# EAGLE design LoRa ST Sensor Node v2.0 (EAGLE 7.5.0)
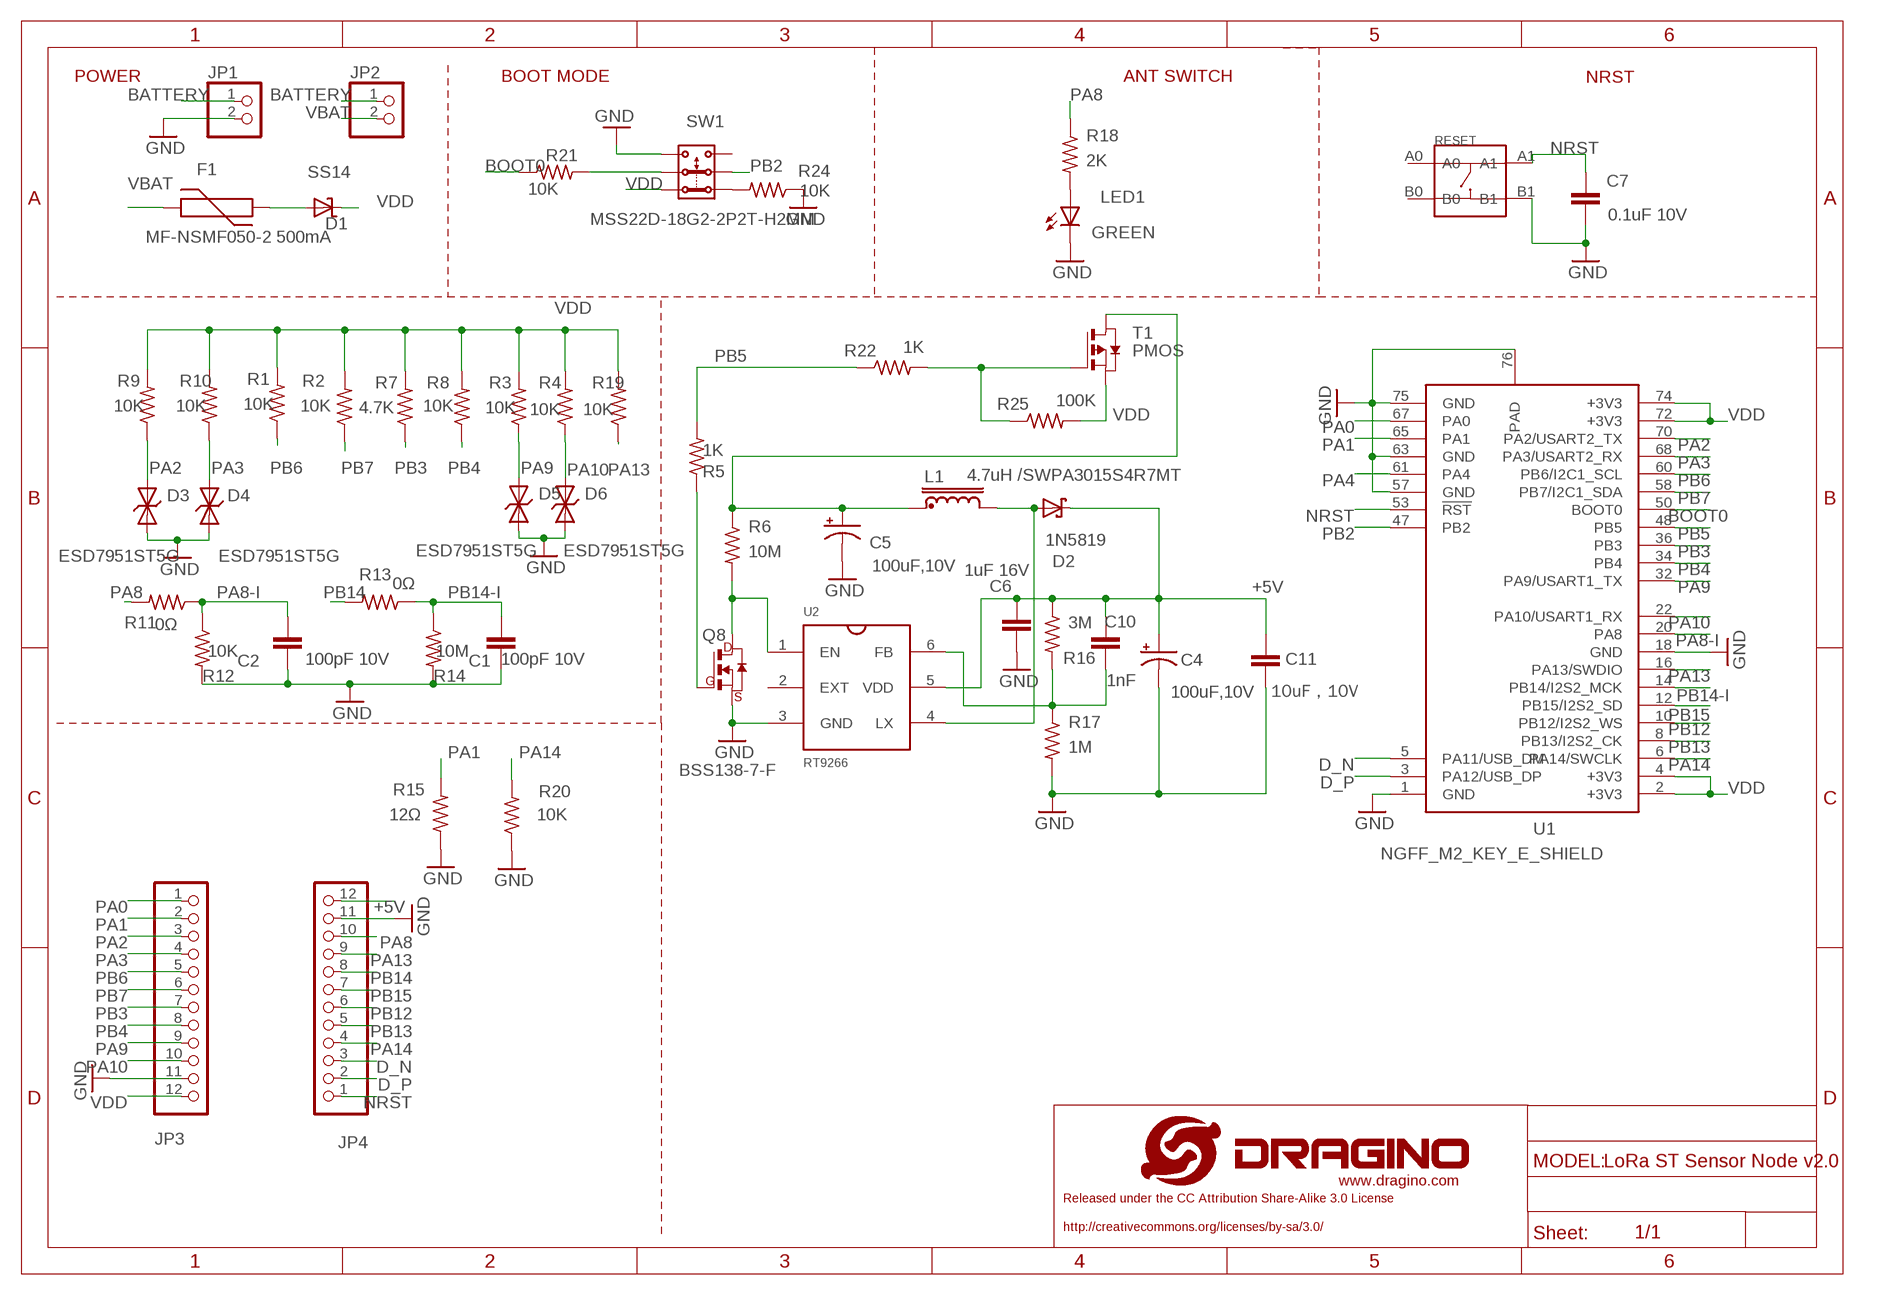
[diagram p0: schematic, sheet 1]

## Parts
C1  100pF 10V  C-EUC0603  [C0603]
C2  100pF 10V  C-EUC0603  [C0603]
C4  100uF,10V  CPOL-USSMCB  [SMC_B]
C5  100uF,10V  CPOL-USSMCB  [SMC_B]
C6  1uF 16V  C-EUC0603  [C0603]
C7  0.1uF 10V  C-EUC0402  [C0402]
C10  1nF  C-EUC0402  [C0402]
C11  10uF，10V  C-EUC0805  [C0805]
D1  SS14  SCHOTTKYSMBG  [DO214AC]
D2  1N5819  SMF5.0AT1  [SOD123FL]
D3  ESD7951ST5G  TVSSOD−923  [SOD−923]
D4  ESD7951ST5G  TVSSOD−923  [SOD−923]
D5  ESD7951ST5G  TVSSOD−923  [SOD−923]
D6  ESD7951ST5G  TVSSOD−923  [SOD−923]
F1  MF-NSMF050-2 500mA  FUSE1206  [R1206]
JP1  PINHD-1X2L  [XH2.54-2P-L]
JP2  PINHD-1X2  [1X02]
JP3  PINHD-1X12""  [1X12-DIP]
JP4  PINHD-1X12""  [1X12-DIP]
L1  4.7uH /SWPA3015S4R7MT  INDUCTORSWPA3010S  [SWPA3010S]
LED1  GREEN  LEDCHIPLED_0603  [CHIPLED_0603]
Q8  BSS138-7-F  NMOSFET  [SOT-23]
R1  10K  R-US_R0402  [R0402]
R2  10K  R-US_R0402  [R0402]
R3  10K  R-US_R0402  [R0402]
R4  10K  R-US_R0402  [R0402]
R5  1K  R-US_R0402  [R0402]
R6  10M  R-US_R0402  [R0402]
R7  4.7K  R-US_R0402  [R0402]
R8  10K  R-US_R0402  [R0402]
R9  10K  R-US_R0402  [R0402]
R10  10K  R-US_R0402  [R0402]
R11  0Ω  R-US_R0603  [R0603]
R12  10K  R-US_R0603  [R0603]
R13  0Ω  R-US_R0603  [R0603]
R14  10M  R-US_R0603  [R0603]
R15  12Ω  R-US_R1206  [R1206@1]
R16  3M  R-US_R0402  [R0402]
R17  1M  R-US_R0402  [R0402]
R18  2K  R-US_R0402  [R0402]
R19  10K  R-US_R0402  [R0402]
R20  10K  R-US_R0402  [R0402]
R21  10K  R-US_R0402  [R0402]
R22  1K  R-US_R0402  [R0402]
R24  10K  R-US_R0402  [R0402]
R25  100K  R-US_R0402  [R0402]
RESET  轻触开关3*3*1.5四脚贴片开关  BUTTON-4P-3.3X3.3  [SW4-SMD-3.35X3.35X1.5MM]
SW1  MSS22D-18G2-2P2T-H2MM  [MSS22D-18G2-2P2T-H2MM-DIL]
T1  PMOS  PMOSSOT23  [SOT-23]
U1  NGFF_M2_KEY_E_SHIELD  [NGFF_M2_KEY_E_SHIELD]
U2  RT9266  [6/SOT-23]

## Nets
+5V: C4.+ C6.2 C10.2 C11.2 D2.C JP4.12 R16.1 U2.5(VDD)
BATTERY: JP1.1 JP2.1
BOOT0: R21.1 U1.50(BOOT0)
D_N: JP4.3 U1.5(PA11/USB_DM)
D_P: JP4.2 U1.3(PA12/USB_DP)
GND: C1.1 C2.1 C4.- C5.- C6.1 C7.1 C11.1 D3.P$2 D4.P$2 D5.P$2 D6.P$2 JP1.2 JP3.11 JP4.11 LED1.C Q8.2(S) R12.2 R14.2 R15.1 R17.2 R20.1 R24.1 RESET.B1 SW1.1 U1.1(GND) U1.18(GND) U1.57(GND) U1.63(GND) U1.75(GND) U1.76(PAD) U2.3(GND)
N$3: LED1.A R18.2
N$4: R24.2 SW1.4
N$5: Q8.3(G) R5.1
N$6: C10.1 R16.2 R17.1 U2.6(FB)
N$7: D2.A L1.P$2 U2.4(LX)
N$9: Q8.1(D) R6.2 U2.1(EN)
N$10: R22.2 R25.1 T1.3(G)
N$11: D1.A F1.1
N$13: C5.+ L1.P$1 R6.1 T1.1(D)
N$22: R21.2 SW1.2
NRST: C7.2 JP4.1 RESET.A1 U1.53(!RST)
PA0: JP3.1 U1.67(PA0)
PA1: JP3.2 R15.2 U1.65(PA1)
PA2: D3.P$1 JP3.3 R9.1 U1.70(PA2/USART2_TX)
PA3: D4.P$1 JP3.4 R10.1 U1.68(PA3/USART2_RX)
PA4: U1.61(PA4)
PA8: JP4.10 R11.2 R18.1
PA8-I: C2.2 R11.1 R12.1 U1.20(PA8)
PA9: D5.P$1 JP3.9 R3.1 U1.32(PA9/USART1_TX)
PA10: D6.P$1 JP3.10 R4.1 U1.22(PA10/USART1_RX)
PA13: JP4.9 R19.1 U1.16(PA13/SWDIO)
PA14: JP4.4 R20.2 U1.6(PA14/SWCLK)
PB2: SW1.5 U1.47(PB2)
PB3: JP3.7 R7.1 U1.36(PB3)
PB4: JP3.8 R8.1 U1.34(PB4)
PB5: R5.2 R22.1 U1.48(PB5)
PB6: JP3.5 R1.1 U1.60(PB6/I2C1_SCL)
PB7: JP3.6 R2.1 U1.58(PB7/I2C1_SDA)
PB12: JP4.6 U1.10(PB12/I2S2_WS)
PB13: JP4.5 U1.8(PB13/I2S2_CK)
PB14: JP4.8 R13.2
PB14-I: C1.2 R13.1 R14.1 U1.14(PB14/I2S2_MCK)
PB15: JP4.7 U1.12(PB15/I2S2_SD)
VBAT: F1.2 JP2.2
VDD: D1.C JP3.12 R1.2 R2.2 R3.2 R4.2 R7.2 R8.2 R9.2 R10.2 R19.2 R25.2 SW1.3 T1.2(S) U1.2(+3V3) U1.4(+3V3) U1.72(+3V3) U1.74(+3V3)
Unconnected: RESET.A0 RESET.B0 SW1.6 U2.2(EXT)

## Notes on the sheet
- NRST
- POWER | BOOT MODE | ANT SWITCH

## Library data of the parts
C1 C2 C6 C7 C10 = dragino:C-EU: CAPACITOR, European symbol
C4 C5 = rcl:CPOL-US: POLARIZED CAPACITOR, American symbol
C11 = dragino-passive:C-EU: CAPACITOR, European symbol
D1 = dragino:SCHOTTKY: Suppressor diode; OC_FARNELL: unknown
D2 = diode:SMF5.0AT1: 200 W Transient Voltage Suppressor Source: Data sheet <http://www.onsemi.com/pub_link/Collateral/SMF5.0AT1-D.PDF>
D3-D6 = dragino:TVS: DIODE
F1 = dragino:FUSE: FUSE 5 x 20 mm
JP1 JP2 = pinhead:PINHD-1X2: PIN HEADER
JP3 JP4 = pinhead:PINHD-1X12: PIN HEADER
L1 = dragino:INDUCTOR: CHOKE U15
LED1 = dragino:LED: LED OSRAM: - CHIPLED LG R971, LG N971, LY N971, LG Q971, LY Q971, LO R971, LY R971 LH N974, LH R974 LS Q976, LO Q976, LY Q976 LO Q996 - Hyper CHIPLED LW Q18S LB Q993, LB Q99A, LB R99A - SideLED LS A670, LO A670, LY A670, LG A670, LP A670 LB A673, LV A673, LT A673, LW A673 LH A674 LY A675 LS A676, LA A676, LO A676, LY A676, LW A676 LS A679, LY A679, LG A679 - Hyper Micro SIDELED® LS Y876, LA Y876, LO Y876, LY Y876 LT Y87S - SmartLED LW L88C, LW L88S LB L89C, LB L89S, LG L890 LS L89K, LO L89K, LY L89K LS L896, LA L896, LO L896, LY L896 - TOPLED LS T670, LO T670, LY T670, LG T670, LP T670 LSG T670, LSP T670, LSY T670, LOP T670, LYG T670 LG T671, LOG T671, LSG T671 LB T673, LV T673, LT T673, LW T673 LH T674 LS T676, LA T676, LO T676, LY T676, LB T676, LH T676, LSB T676, LW T676 LB T67C, LV T67C, LT T67C, LS T67K, LO T67K, LY T67K, LW E67C LS E67B, LA E67B, LO E67B, LY E67B, LB E67C, LV E67C, LT E67C LW T67C LS T679, LY T679, LG T679 LS T770, LO T770, LY T770, LG T770, LP T770 LB T773, LV T773, LT T773, LW T773 LH T774 LS E675, LA E675, LY E675, LS T675 LS T776, LA T776, LO T776, LY T776, LB T776 LHGB T686 LT T68C, LB T68C - Hyper Mini TOPLED® LB M676 - Mini TOPLED Santana® LG M470 LS M47K, LO M47K, LY M47K Source: http://www.osram.convergy.de LUXEON: - LUMILED® LXK2-PW12-R00, LXK2-PW12-S00, LXK2-PW14-U00, LXK2-PW14-V00 LXK2-PM12-R00, LXK2-PM12-S00, LXK2-PM14-U00 LXK2-PE12-Q00, LXK2-PE12-R00, LXK2-PE12-S00, LXK2-PE14-T00, LXK2-PE14-U00 LXK2-PB12-K00, LXK2-PB12-L00, LXK2-PB12-M00, LXK2-PB14-N00, LXK2-PB14-P00, LXK2-PB14-Q00 LXK2-PR12-L00, LXK2-PR12-M00, LXK2-PR14-Q00, LXK2-PR14-R00 LXK2-PD12-Q00, LXK2-PD12-R00, LXK2-PD12-S00 LXK2-PH12-R00, LXK2-PH12-S00 LXK2-PL12-P00, LXK2-PL12-Q00, LXK2-PL12-R00 Source: www.luxeon.com KINGBRIGHT: KA-3528ASYC Source: www.kingbright.com
Q8 = dragino:NMOSFET: MOS FET; OC_FARNELL: unknown; OC_NEWARK: unknown
R1-R22 R24 R25 = dragino:R-US_: RESISTOR, American symbol
RESET = dragino:BUTTON-4P: SW4-6.0X6.0X5.0MM:311020024;SW4-8.0X8.0X9.0MM:311020028;SW4-SMD-6.0X6.0X5.0MM:311020004;SW4-SMD-3.35X3.35X1.5MM:311020030;SW4-SMD-5.2X5.2X2.5MM:311020046
SW1 = dragino:MSS22D-18G2-2P2T-H2MM
T1 = zetex:PMOSSOT23: MOS FET; OC_FARNELL: unknown; OC_NEWARK: unknown
U1 = dragino:NGFF_M2_KEY_E_SHIELD
U2 = dragino:RT9266

## Net classes
0 default: width 0.203 mm, clearance 0.203 mm
1 vcc: width 0.254 mm

## Board
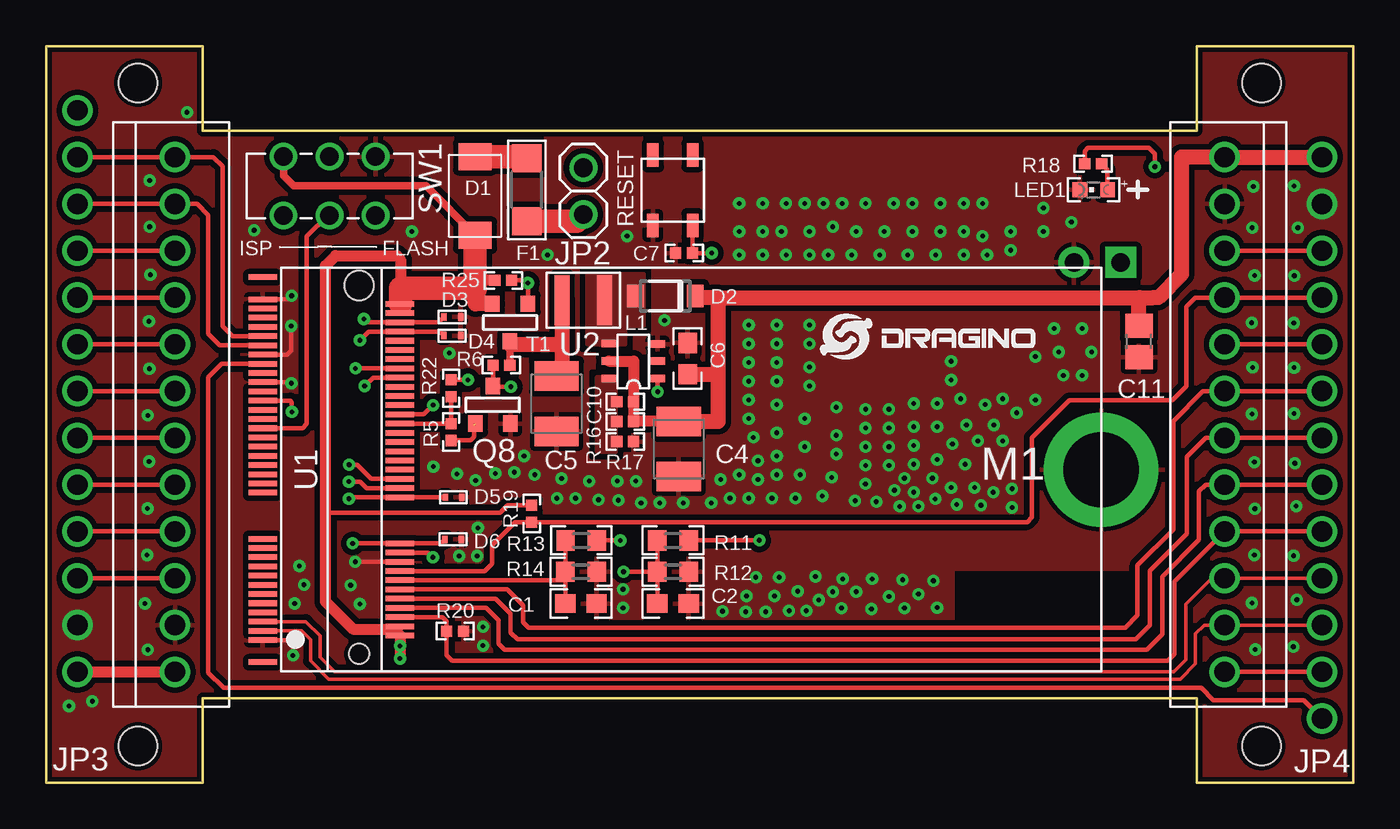
[diagram p1: board, top side]
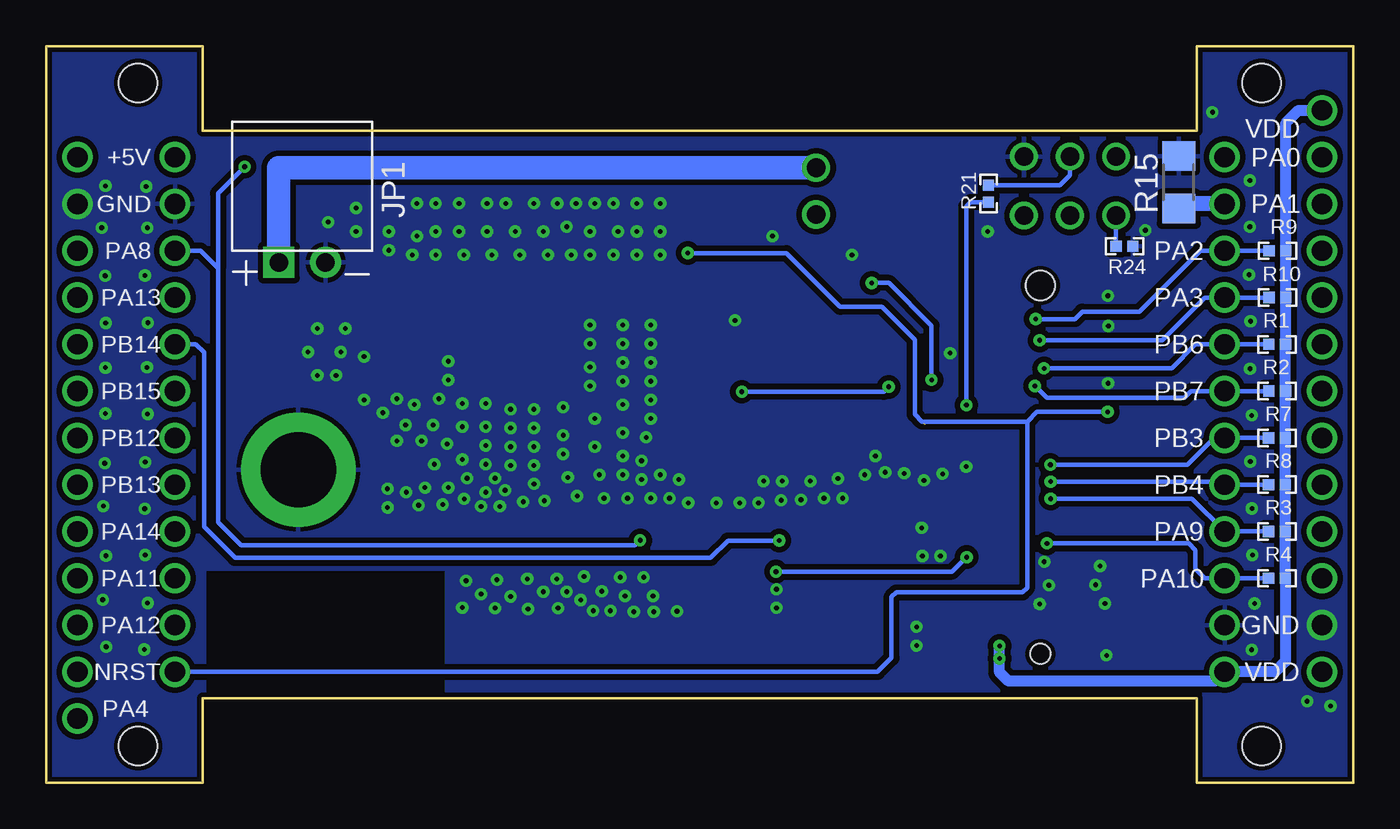
[diagram p2: board, bottom side, seen from below]

Size 71 x 40 mm. Coordinates in mm from the lower left corner, seen from the top.
Copper layers (1*16): Top 0.035mm / dielectric 1.5mm / Bottom 0.035mm
Design rules "default *": minimum track width 6mil, minimum drill 10mil, track to track 12mil, track to pad 20mil, pad to pad 10mil, via to via 10mil, smd to smd 8mil, copper to edge 10mil, drill to drill 8mil, minimum pad ring 10mil, minimum via ring 8mil, stop-mask expansion 4mil, vias tented up to drill 30mil, thermal gap 10mil

### Footprints (pad centres in the part's own frame; a part is rotated, then mirrored left to right if it is on the bottom)
C0603 = smd 1.1 x 1: 1 -0.85,0; 2 0.85,0
SMC_B = smd 1.6 x 2.4: + -1.5,0; - 1.5,0
C0402 = smd 0.61 x 0.61: 1 -0.457,0; 2 0.457,0
C0805 = smd 1.3 x 1.5: 1 -0.85,0; 2 0.85,0
DO214AC = smd 1.45 x 1.8: A 2.13,0; C -2.13,0
SOD123FL = smd 0.91 x 1.22: A 1.625,0; C -1.625,0
SOD−923 = smd 0.3 x 0.4: P$1 -0.45,0; P$2 0.45,0
R1206 = smd 1.52 x 1.6: 1 -1.71,0; 2 1.71,0
XH2.54-2P-L = drill 1 pad 1.676 square: 1 -1.27,-0.635 | drill 1 pad 1.676: 2 1.27,-0.635
1X02 = drill 1.016: 1 -1.27,0; 2 1.27,0
1X12-DIP = drill 1.1: 1 -13.97,0; 2 -11.43,0; 3 -8.89,0; 4 -6.35,0; 5 -3.81,0; 6 -1.27,0; 7 1.27,0; 8 3.81,0; 9 6.35,0; 10 8.89,0; 11 11.43,0; 12 13.97,0
SWPA3010S = smd 0.8 x 2.7: P$1 -1.15,0; P$2 1.15,0
CHIPLED_0603 = smd 0.8 x 0.8: A 0,-0.75; C 0,0.75
SOT-23 = smd 0.787 x 0.889: 1 0,-1.016; 2 -0.95,1.016; 3 0.95,1.016
R0402 = smd 0.61 x 0.61: 1 -0.457,0; 2 0.457,0
R0603 = smd 1 x 1.1: 1 -0.85,0; 2 0.85,0
R1206@1 = smd 1.6 x 1.803: 1 -1.422,0; 2 1.422,0
SW4-SMD-3.35X3.35X1.5MM = smd 1.27 x 0.635: A0 -1.905,1.079; A1 1.905,1.079; B0 -1.905,-1.079; B1 1.905,-1.079
MSS22D-18G2-2P2T-H2MM-DIL = drill 1: 1 -2.5,-1.6; 2 0,-1.6; 3 2.5,-1.6; 4 2.5,1.6; 5 0,1.6; 6 -2.5,1.6
SOT-23' = smd 0.787 x 0.889: 1 0.025,-1.016; 2 -0.94,1.016; 3 0.991,1.016
NGFF_M2_KEY_E_SHIELD = smd 0.3 x 1.55: 1 1.7,-0.775; 2 1.95,-8.225; 3 2.2,-0.775; 4 2.45,-8.225; 5 2.7,-0.775; 6 2.95,-8.225; 7 3.2,-0.775; 8 3.45,-8.225; 9 3.7,-0.775; 10 3.95,-8.225; 11 4.2,-0.775; 12 4.45,-8.225; 13 4.7,-0.775; 14 4.95,-8.225; 15 5.2,-0.775; 16 5.45,-8.225; 17 5.7,-0.775; 18 5.95,-8.225; 19 6.2,-0.775; 20 6.45,-8.225; 21 6.7,-0.775; 22 6.95,-8.225; 23 7.2,-0.775; 32 9.45,-8.225; 33 9.7,-0.775; 34 9.95,-8.225; 35 10.2,-0.775; 36 10.45,-8.225; 37 10.7,-0.775; 38 10.95,-8.225; 39 11.2,-0.775; 40 11.45,-8.225; 41 11.7,-0.775; 42 11.95,-8.225; 43 12.2,-0.775; 44 12.45,-8.225; 45 12.7,-0.775; 46 12.95,-8.225; 47 13.2,-0.775; 48 13.45,-8.225; 49 13.7,-0.775; 50 13.95,-8.225; 51 14.2,-0.775; 52 14.45,-8.225; 53 14.7,-0.775; 54 14.95,-8.225; 55 15.2,-0.775; 56 15.45,-8.225; 57 15.7,-0.775; 58 15.95,-8.225; 59 16.2,-0.775; 60 16.45,-8.225; 61 16.7,-0.775; 62 16.95,-8.225; 63 17.2,-0.775; 64 17.45,-8.225; 65 17.7,-0.775; 66 17.95,-8.225; 67 18.2,-0.775; 68 18.45,-8.225; 69 18.7,-0.775; 70 18.95,-8.225; 71 19.2,-0.775; 72 19.45,-8.225; 73 19.7,-0.775; 74 19.95,-8.225; 75 20.2,-0.775; X 0.5,-0.775; Y 21.4,-0.775 | drill 4.09 pad 6.2: 76 10.95,-46.3 | hole 1.6: 20.95,-6 | hole 1.1: 0.95,-6
6/SOT-23 = smd 0.406 x 0.813: 1 -0.965,-1.372; 2 -0.015,-1.372; 3 0.911,-1.372; 4 0.937,1.27; 5 -0.015,1.27; 6 -0.965,1.27
LORA_ST_SENSOR_NODE_V2 = hole 2.1: -30.5,18; 30.5,18; -30.5,-18; 30.5,-18

### Placement (x,y rotation side)
C1  29.05,9.74 180 top
C2  34.05,9.74 180 top
C4  34.36,18.12 270 top
C5  27.73,20.59 270 top
C6  34.84,23.04 270 top
C7  34.65,28.77 0 top
C10  31.45,20.69 0 top
C11  59.35,23.96 90 top
D1  23.3,31.86 90 top
D2  33.63,26.44 180 top
D3  22.06,25.3 0 top
D4  22.06,24.28 0 top
D5  22.13,15.5 0 top
D6  22.11,13.22 0 top
F1  26.1,32.19 270 top
JP1  57.09,28.89 0 bottom
JP2  29.18,32.12 270 top
JP3  7,20 270 top
JP4  64,20 90 top
L1  29.17,26.2 0 top
LED1  56.9,32.2 90 top
Q8  24.27,20.52 180 top
R1  4.14,23.81 0 bottom
R2  4.15,21.27 0 bottom
R3  4.15,13.65 0 bottom
R4  4.15,11.11 0 bottom
R5  22,19.05 90 top
R6  24.73,22.68 180 top
R7  4.15,18.73 0 bottom
R8  4.15,16.19 0 bottom
R9  4.13,28.89 0 bottom
R10  4.13,26.35 0 bottom
R11  34.05,13.16 0 top
R12  34.05,11.46 0 top
R13  29.06,13.16 0 top
R14  29.05,11.46 0 top
R15  9.49,32.6 270 bottom
R16  31.45,19.62 180 top
R17  31.45,18.53 0 top
R18  56.86,33.61 0 top
R19  26.37,14.61 90 top
R20  22.21,8.24 180 top
R21  19.82,31.98 90 bottom
R22  22,21.42 90 top
R24  12.43,29.13 180 bottom
R25  24.83,27.28 180 top
RESET  34.03,32.17 270 top
SW1  15.39,32.4 180 top
T1  PMOS  [SOT-23']  25.17,24.99 0 top
U1  11,6.05 90 top
U2  31.84,22.91 90 top
U$1  [LORA_ST_SENSOR_NODE_V2]  35.5,20 0 top
U$2  LOGO-NEW  [LOGO-SILK-NEW]  42.02,23 0 top

### Tracks (layer width: path | path; a pad name or v marks a point on that pad's centre or on a via)
+5V  (via drill 1.1)
  Top 0.61: U2.5 31.9,22.89 C10.2 R16.1 C4.+
  Top 0.813: 34.94,22.29 C6.2 36.52,22.19 | C4.+ 36.52,19.62 36.52,22.19 | 36.52,22.19 36.52,26.35 | 36.52,26.35 35.26,26.35 D2.C | 36.52,26.35 59.38,26.35 | 59.38,26.35 60.14,26.35 60.39,26.35 61.66,27.62 61.66,33.97 JP4.12 v69.29,33.97 | C11.2 59.35,26.32 59.38,26.35
BATTERY
  Bottom 1.27: JP1.1 58.36,33.39 JP2.1
BOOT0  (via drill 0.25)
  Top 0.254: U1.50 20.52,20 v21.02,20.51
  Bottom 0.254: v21.02,20.51 21.02,31.3 20.8,31.53 R21.1
D_N  (via drill 1.1)
  Top 0.203: U1.5 14.1,8.75 14.88,7.98 14.88,6.83 15.67,6.04 61.26,6.04 61.89,6.68 61.89,9.7 63.3,11.11 JP4.3 v69.29,11.11
D_P  (via drill 1.1)
  Top 0.203: U1.3 13.88,8.25 14.37,7.77 14.37,6.62 15.35,5.64 61.59,5.64 62.42,6.47 62.42,8.09 62.91,8.57 JP4.2 v69.29,8.57
GND  (via drill 0.25, 1.1)
  Top 0.254: U1.63 13.1,23.25 13.31,23.47 v13.31,24.8 | U1.18 v16.79,12 | D3.P$2 22.49,25.32 | U1.1 13.41,7.75 v13.41,6.92 | U1.75 13.15,26.25 v13.34,26.44 | U1.57 13.26,21.75 v13.32,21.69
  other vias: 49.98,19.43 23.73,8.47 1.71,8.57 69.29,31.43 14.01,10.76 5.37,9.74 7.66,36.41 22.32,16.78 40.82,10.4 40.35,9.35 13.76,11.77 13.5,9.74 51,20.54 52.71,20.09 50.6,18.57 51.95,18.57 49.22,18.4 49.15,16.03 47.12,15.77 44.49,16.23 51.95,20.85 46.07,15.89 43.93,15.32 45.09,15.27 48.29,15.42 49.46,15.11 50.77,15.08 51.48,19.43 50.42,16.03 51.44,15.77 67.92,9.94 67.81,17.35 65.61,17.41 67.77,20.05 65.49,20.03 67.73,7.39 67.75,12.33 67.89,15.02 41.97,9.93 41.79,11.2 65.64,14.88 65.61,12.37 65.49,9.77 65.66,7.24 65.52,22.56 67.77,22.54 65.47,24.98 67.76,24.97 65.63,27.55 67.78,27.53 65.5,30.14 67.98,30.14 65.56,32.37 67.77,32.41 5.63,32.7 5.63,30.19 5.59,25.06 5.62,22.48 5.67,27.58 5.53,19.95 5.6,17.45 5.51,14.9 5.49,12.37 5.53,7.23 25.43,16.87 26.54,16.73 24.4,16.8 21.04,17.17 2.52,4.43 1.25,4.18 43.26,11.07 44.86,11.07 46.51,11.02 48.19,10.97 48.39,9.51 46.61,9.49 44.82,9.44 43.2,9.49 21.9,23.33 25.96,17.74 23.32,16.42 36.63,16.47 28,16.52 27.74,15.46 28.76,15.46 30,15.37 31.08,15.34 32.31,15.2 33.33,15.2 34.6,15.2 36.12,15.2 37.14,15.46 38.16,15.46 44.51,17.23 44.51,18.25 44.51,19.27 44.51,20.28 45.78,20.28 45.78,19.27 45.78,18.25 45.78,17.23 47.12,17.3 47.12,18.31 47.12,19.33 47.12,20.6 48.39,20.6 48.39,19.33 48.39,17.55 48.14,16.54 49.92,17.3 49.66,20.85 53.73,23.14 55,23.39 56.77,23.39 44,10.38 45.78,10.12 42.73,10.38 53.73,20.79 52.46,15.96 52.46,14.95 46.36,15.01 47.38,15.01 46.61,16.54 23.41,12.32 33.58,25.11 31.34,9.5 36.73,9.32 38,9.3 39.08,9.3 38.04,10.15 38.55,11.16 39.82,11.16 39.56,10.15 41.29,9.35 47.38,10.25 29.49,16.38 31.02,16.38 32.03,16.38 37.65,16.73 38.66,17.49 38.16,19.77 38.16,20.79 38.16,21.81 38.16,22.82 38.16,23.84 38.16,24.85 39.68,24.85 39.68,23.84 39.68,22.82 39.68,21.81 39.68,20.54 39.68,19.01 38.41,18.76 39.68,17.74 39.68,16.73 38.66,16.47 39.43,15.46 40.7,15.46 40.95,16.73 41.2,18.25 41.2,19.77 41.46,21.55 41.46,22.57 41.46,23.84 41.46,24.85 42.16,15.57 42.66,16.59 42.92,17.86 42.92,18.87 42.92,20.4 54.74,24.66 56.27,24.66 56.27,22.12 55.25,22.12 49.15,22.89 49.15,21.87 16.54,10.73 17.05,9.71 23.73,7.45 31.34,10.52 23.45,13.84 22.43,12.32 11.3,30 31.55,29.68 19.87,29.93 27.23,28.66 37.65,28.66 37.65,29.93 37.65,31.46 38.92,31.46 40.19,31.46 41.2,31.46 42.22,31.46 43.24,31.46 44.51,31.46 46.03,31.46 47.05,31.46 48.57,31.46 49.84,31.46 50.86,31.46 50.86,29.68 49.84,29.93 48.57,29.93 47.05,29.93 45.52,29.93 44,29.93 42.73,30.19 41.46,29.93 39.93,29.93 38.92,29.93 38.92,28.66 40.19,28.66 41.46,28.66 42.47,28.66 43.74,28.66 45.27,28.66 46.79,28.66 48.32,28.66 49.84,28.66 51.11,28.66 52.38,29.93 52.38,28.92 54.16,31.2 54.16,29.93 55.68,30.44
  pour Bottom (rank 2): -0.06,40.07 8.58,40.07 8.58,35.49 62.42,35.49 62.42,40.07 71.06,40.07 71.06,-0.07 62.42,-0.07 62.42,11.62 49.22,11.62 49.22,4.51 8.58,4.51 8.58,-0.07 -0.06,-0.07
  pour Top (rank 2): -0.06,40.07 8.58,40.07 8.58,35.49 62.42,35.49 62.42,40.07 71.06,40.07 71.06,-0.07 62.42,-0.07 62.42,11.62 49.22,11.62 49.22,4.51 8.58,4.51 8.58,-0.07 -0.06,-0.07
N$3
  Top 0.254: R18.2 57.65,33.29 LED1.A
N$4
  Bottom 0.254: SW1.4 R24.2
N$5  (1 unrouted)
  Top 0.254: R5.1 23.06,18.59 23.26,18.78 23.26,19.44
N$6
  pour Top (no thermals): 29.91,22.03 30.93,22.03 30.93,17.97 29.91,17.97
N$7
  pour Top (no thermals): 29.4,27.62 32.45,27.62 32.45,24.83 31.44,24.83 31.44,23.81 29.4,23.81
N$9  (via drill 0.25)
  Top 0.254: R6.2 Q8.1 24.31,21.5 v25.24,21.5 | U2.1 v33.21,21.23
  Bottom 0.254: v25.24,21.5 25.5,21.23 v33.21,21.23
N$10  (via drill 0.25)
  Top 0.254: R22.2 v22.91,21.88 | R25.1 26.02,27.28 v26.16,27.14 T1.3
  Bottom 0.254: v22.91,21.88 22.91,24.83 25.23,27.14 v26.16,27.14
N$11
  Top 1.27: D1.A 26.01,33.99 F1.1
N$13
  Top 0.406: R6.1 T1.1
  Top 0.813: L1.P$1 28.02,23.81 | 28.02,23.81 28.02,22.09 C5.+ | T1.1 25.2,23.81 28.02,23.81
N$22
  Bottom 0.254: SW1.2 15.39,32.99 15.95,32.44 R21.2
NRST  (via drill 0.25, 1.1)
  Top 0.254: JP4.1 v69.29,6.03 | U1.53 13.27,20.75 13.35,20.67 v13.35,20.14 | C7.2 | C7.2 v36.15,28.77 v36.15,28.76 | C7.2 RESET.A1
  Bottom 0.254: JP4.1 25.85,6.03 25.09,6.79 25.09,10.09 24.83,10.35 17.97,10.35 17.72,10.6 17.72,19.61 | 17.72,19.61 17.19,20.14 v13.35,20.14 | v36.15,28.76 30.8,28.76 27.88,25.84 25.59,25.84 23.82,24.06 23.82,20 23.42,19.61 17.72,19.61
PA0  (via drill 1.1)
  Top 0.254: 7.01,33.97 JP3.1 | JP3.1 v1.71,33.97 | JP3.1 9.08,33.97 9.59,33.46 9.59,24.79 10.12,24.25 U1.67
PA1  (via drill 1.1)
  Top 0.254: v1.71,31.43 JP3.2 8.2,31.43 8.8,30.82 8.8,24.38 9.43,23.75 U1.65
  Bottom 0.813: JP3.2 9.49,31.43 R15.2
PA2  (via drill 0.25, 1.1)
  Top 0.254: v17.26,25.18 17.44,25 U1.70 21.32,25 D3.P$1 | v1.71,28.89 JP3.3
  Bottom 0.254: v17.26,25.18 15.13,25.18 14.72,25.59 11.62,25.59 8.32,28.89 JP3.3 R9.1
PA3  (via drill 0.25, 1.1)
  Top 0.254: v17.05,24.03 17.52,24.5 U1.68 21.39,24.5 D4.P$1 | v1.71,26.35 JP3.4
  Bottom 0.254: R10.1 JP3.4 8.07,26.35 10.39,24.03 v17.05,24.03
PA4  (via drill 1.1)
  Top 0.254: U1.61 9.55,22.75 8.82,22.02 8.82,5.98 9.64,5.15 62.73,5.15 63.4,4.48 68.3,4.48 v69.29,3.49
PA8  (via drill 0.25, 1.1)
  Top 0.254: R11.2 v38.73,13.16 v38.74,13.17 | JP4.10 v69.29,28.89 | R18.1 56.41,34.3 56.58,34.48 59.88,34.48 60.21,34.15 v60.21,33.45
  Bottom 0.254: v38.74,13.17 39.02,12.89 60.39,12.89 61.66,14.16 61.66,27.87 61.66,27.94 | 61.66,27.94 62.61,28.89 JP4.10 | v60.21,33.45 61.66,32 61.66,27.94
PA8-I  (via drill 0.25)
  Top 0.254: R12.1 R11.1 | C2.2 R12.1 | v31.36,11.47 R12.1 | U1.20 20.76,12.5 v21.01,12.25
  Bottom 0.254: v31.36,11.47 21.8,11.47 v21.01,12.25
PA9  (via drill 0.25, 1.1)
  Top 0.254: v1.71,13.65 JP3.9 | D5.P$1 U1.32 16.52,15.5 v16.45,15.43
  Bottom 0.254: R3.1 JP3.9 8.78,15.43 v16.45,15.43
PA10  (via drill 0.25, 1.1)
  Top 0.254: v1.71,11.11 JP3.10 | v16.65,13 U1.22 21.45,13 D6.P$1 | v16.65,13
  Bottom 0.254: R4.1 JP3.10 8.07,11.11 8.58,11.62 8.58,12.63 8.94,13 v16.65,13
PA13  (via drill 1.1)
  Top 0.254: U1.16 23.83,11.5 24.22,11.9 24.22,12.9 25.48,14.16 R19.1 53.28,14.16 53.53,14.41 53.53,18.73 55.57,20.76 61.15,20.76 61.92,21.52 61.92,25.84 62.42,26.35 JP4.9 v69.29,26.35
PA14  (via drill 1.1)
  Top 0.254: v69.29,13.65 JP4.4 61.27,10.92 61.27,6.98 60.92,6.64 22.05,6.64 21.76,6.93 R20.2 21.76,8.79 21.54,9 U1.6
PB2
  Top 0.254: U1.47 13.92,19.25 14.16,19.49 14.16,29.67 15.3,30.8 SW1.5
PB3  (via drill 0.25, 1.1)
  Top 0.254: v1.71,18.73 JP3.7 | U1.36 17.66,16.5 16.89,17.27 v16.46,17.27
  Bottom 0.254: R7.1 JP3.7 7.56,18.73 9.02,17.27 v16.46,17.27
PB4  (via drill 0.25, 1.1)
  Top 0.254: v1.71,16.19 JP3.8 | U1.34 17.4,16 17.05,16.36 v16.45,16.36
  Bottom 0.254: R8.1 JP3.8 7.16,16.36 v16.45,16.36
PB5
  Top 0.254: U1.48 R5.2 R22.1
PB6  (via drill 0.25, 1.1)
  Top 0.254: v1.71,23.81 JP3.5 | U1.60 v16.81,22.5 | v16.81,22.5
  Bottom 0.254: v16.81,22.5 16.79,22.52 9.87,22.52 8.58,23.81 JP3.5 R1.1
PB7  (via drill 0.25, 1.1)
  Top 0.254: U1.58 17.75,22 v17.3,21.55 | v1.71,21.27 JP3.6
  Bottom 0.254: R2.1 JP3.6 8.83,21.27 9.2,20.9 16.65,20.9 v17.3,21.55
PB12  (via drill 1.1)
  Top 0.254: U1.10 24.42,10 25.24,9.18 25.24,8.16 25.59,7.81 59.17,7.81 59.94,8.57 59.94,11.5 61.95,13.52 61.95,17.7 62.98,18.73 JP4.6 v69.29,18.73
PB13  (via drill 1.1)
  Top 0.254: U1.8 23.9,9.5 24.58,8.82 24.58,7.55 24.91,7.22 59.77,7.22 60.61,8.06 60.61,11.2 62.61,13.21 62.61,15.82 62.98,16.19 JP4.5 | JP4.5 v69.29,16.19 | 63.64,16.19 JP4.5
PB14  (via drill 0.25, 1.1)
  Top 0.254: JP4.8 v69.29,23.81 | R13.2 v31.18,13.16
  Bottom 0.254: JP4.8 62.87,23.81 62.42,23.37 62.42,13.9 60.73,12.21 34.92,12.21 33.98,13.16 v31.18,13.16
PB14-I
  Top 0.254: C1.2 R14.1 | R14.1 28.21,11.46 R13.1 | U1.14 28.2,11 R14.1
PB15  (via drill 1.1)
  Top 0.254: U1.12 25.03,10.5 25.9,9.64 25.9,8.72 26.19,8.43 58.61,8.43 59.27,9.09 59.27,11.82 61.2,13.75 61.2,19.64 62.83,21.27 JP4.7 v69.29,21.27
VBAT
  Top 1.27: F1.2 28.81,30.48 JP2.2
VDD  (via drill 0.25, 1.1)
  Top 0.254: R19.2 25.07,15.07 24.67,14.67 15.18,14.67
  Top 0.305: U1.74 U1.72 | U1.2 U1.4 18.98,8.5 18.98,8.25
  Top 0.406: D1.C 23.31,29.74 20.64,32.41 13.44,32.41 12.89,32.95 SW1.3
  Top 0.61: v1.71,6.03 JP3.12 | 18.98,8.25 18.91,8.32 16.7,8.32 15.18,9.84 15.18,14.67 15.18,28.08 15.73,28.62 19.04,28.62 19.24,28.42 19.24,26.02 U1.74 | R25.2 23.31,27.28 23.31,27.62 | U1.2 v19.23,6.76 v19.22,6.75
  Top 0.813: T1.2 23.31,26.01 23.31,26.86
  Top 1.27: 23.31,27.62 23.31,27.11 | 23.31,27.11 23.31,26.86 | 23.31,26.86 23.31,26.81 | 19.24,26.02 19.24,26.86 23.31,26.86 | D1.C 23.3,27.12 23.31,27.11
  Bottom 0.61: v1.71,36.51 2.99,36.51 3.67,35.83 R9.2 R10.2 3.68,26.34 R1.2 R2.2 R7.2 R8.2 R3.2 R4.2 3.7,6.59 4.26,6.03 JP3.12 7.51,5.52 18.74,5.52 19.22,6.01 v19.22,6.75 v19.22,7.44

### Text on the board
tPlace: ISP | FLASH | M1
bPlace: VDD | PA0 | +5V | PA1 | GND | PA2 | PA8 | PA3 | PA13 | PB6 | PB14 | PB7 | PB15 | PB3 | PB12 | PB4 | PB13 | PA9 | PA14 | PA10 | PA11 | GND | PA12 | VDD | NRST | PA4
tDocu: LSN50 v2.0